# Altium schematic sheet WPT_Transmitter.SchDoc
size A4; SheetNumber: 1; SheetTotal: 1
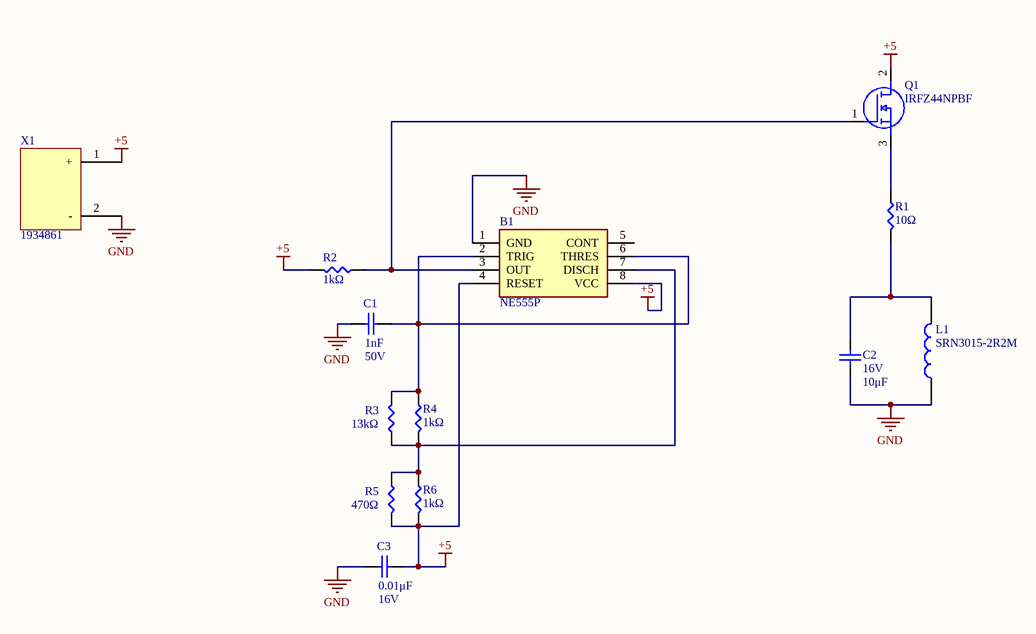
[diagram p0: WPT_Transmitter.SchDoc]

## Parts
B1  NE555P  [DIP794W53P254L959H508Q8N]
C1  value 1nF  Voltage Rating: 50V  [CAP0805]  (hidden comment: GRM1555C1H102JA01D)
C2  value 10μF  Voltage Rating: 16V  [CAP0805]  (hidden comment: CL21A106KOCLRNC)
C3  value 0.01μF  Voltage Rating: 16V  [CAP0402]  (hidden comment: KGM05AR71C103KH)
L1  SRN3015-2R2M  [INDPM3027X150N]
Q1  IRFZ44NPBF  [TO254P483X1016X1994-3P]
R1  value 10Ω  [RES1206]  (hidden comment: RNCP1206FTD10R0)
R2  value 1kΩ  [RES1206]  (hidden comment: RNCP1206FTD1K00)
R3  value 13kΩ  [RES0402]  (hidden comment: RC0402FR-0713KL)
R4  value 1kΩ  [RES1206]  (hidden comment: RNCP1206FTD1K00)
R5  value 470Ω  [RES1206]  (hidden comment: CRGP1206F470R)
R6  value 1kΩ  [RES1206]  (hidden comment: RNCP1206FTD1K00)
X1  1934861  [1934861]

## Nets
+5: B1.4(RESET) B1.8(VCC) C3.2 Q1.2(D) R2.1 R5.1 R6.1 X1.1(+)
GND: B1.1(GND) C1.1 C2.1 C3.1 L1.1 X1.2(-)
NetB1_2: B1.2(TRIG) B1.6(THRES) C1.2 R3.1 R4.2
NetB1_3: B1.3(OUT) Q1.1(G) R2.2
NetB1_7: B1.7(DISCH) R3.2 R4.1 R5.2 R6.2
NetC2_2: C2.2 L1.2 R1.1
NetQ1_3: Q1.3(S) R1.2

Not connected (* = marked no-connect by the designer): B1 5(CONT)

## Library data of the parts
B1 = NE555P_1: Precision timer,NE555P 0.5MHz DIL8 Texas Instruments NE555P, Precision Timer, 4.5  16 V, 8-Pin PDIP; Geometry.Height: 5.08mm; Mouser Part Number: 595-NE555P; Mouser Price/Stock: https://www.mouser.co.uk/ProductDetail/Texas-Instruments/NE555P?qs=rkhjVJ6%2F3EIf4CWgjIKuKQ%3D%3D; Manufacturer_Name: Texas Instruments; Manufacturer_Part_Number: NE555P; Datasheet Link: http://www.ti.com/lit/ds/symlink/ne555.pdf
C1 = GRM1555C1H102JA01D: CAP CER 1000PF 50V C0G/NP0 0402; Manufacturer 1: Murata Electronics; Manufacturer Part Number 1: 490-3244-2-ND; Supplier 1: Digi-Key; Supplier Part Number 1: 1276-2399-2-ND
C2 = CL21A106KOCLRNC: CAP CER 10UF 16V X5R 0805; Manufacturer 1: Samsung Electro-Mechanics; Supplier 1: Digi-Key; Manufacturer Part Number 1: CL21A106KOCLRNC; Supplier Part Number 1: 1276-2399-2-ND
C3 = KGM05AR71C103KH: CAP CER 10000PF 16V X7R 0402; Manufacturer 1: KYOCERA AVX; Supplier 1: Digi-Key; Manufacturer Part Number 1: KGM05AR71C103KH; Supplier Part Number 1: 478-KGM05AR71C103KHTR-ND
L1 = SRN3015-2R2M: Power Inductor semi-shielded SMD 2.2uH Bourns SRN3015 Series Shielded Wire-wound SMD Inductor with a Ferrite Core, 2.2 uH +/-20% 1.8A Idc; Geometry.Height: 1.5mm; Mouser Part Number: 652-SRN3015-2R2M; Mouser Price/Stock: https://www.mouser.co.uk/ProductDetail/Bourns/SRN3015-2R2M?qs=opBjA1TV9012ipbB8adgog%3D%3D; Manufacturer_Name: Bourns; Manufacturer_Part_Number: SRN3015-2R2M; Datasheet Link: *
Q1 = IRFZ44NPBF: MOSFET N-Channel 55V 49A TO220AB Infineon IRFZ44NPBF N-channel MOSFET Transistor, 49 A, 55 V, 3-Pin TO-220AB; Geometry.Height: 4.83mm; Mouser Part Number: 942-IRFZ44NPBF; Mouser Price/Stock: https://www.mouser.co.uk/ProductDetail/Infineon-Technologies/IRFZ44NPBF?qs=9%252BKlkBgLFf24zghzPg2f9g%3D%3D; Manufacturer_Name: Infineon; Manufacturer_Part_Number: IRFZ44NPBF; Datasheet Link: https://www.infineon.com/dgdl/irfz44npbf.pdf?fileId=5546d462533600a40153563b3a9f220d
R1 = RNCP1206FTD10R0: 10 Ohms ±1% 0.5W, 1/2W Chip Resistor 1206 (3216 Metric) Anti-Sulfur Thin Film; Manufacturer 1: Stackpole Electronics Inc; Manufacturer Part Number 1: RNCP1206FTD10R0; Supplier Part Number 1: RNCP1206FTD10R0TR-ND; Supplier 1: Digi-Key; Power Rating: 1/2W
R2 R4 R6 = RNCP1206FTD1K00: RES 1K OHM 1% 1/2W 1206 /; Manufacturer 1: Stackpole Electronics Inc; Manufacturer Part Number 1: RNCP1206FTD1K00; Supplier Part Number 1: RNCP1206FTD1K00TR-ND; Supplier 1: Digi-Key; Power Rating: 1/2W
R3 = RC0402FR-0713KL: RES 13K OHM 1% 1/16W 0402 /; Manufacturer 1: YAGEO; Manufacturer Part Number 1: RC0402FR-0713KL; Supplier Part Number 1: 311-13.0KLRTR-ND; Supplier 1: Digi-Key; Power Rating: 1/16W
R5 = CRGP1206F470R: RES 470 OHM 1% 1/2W 1206 /; Manufacturer 1: TE Connectivity Passive Product; Manufacturer Part Number 1: CRGP1206F470R; Supplier Part Number 1: A130534TR-ND; Supplier 1: Digi-Key; Power Rating: 1/2W